# EAGLE design BATT_DISP (EAGLE 9.6.2)
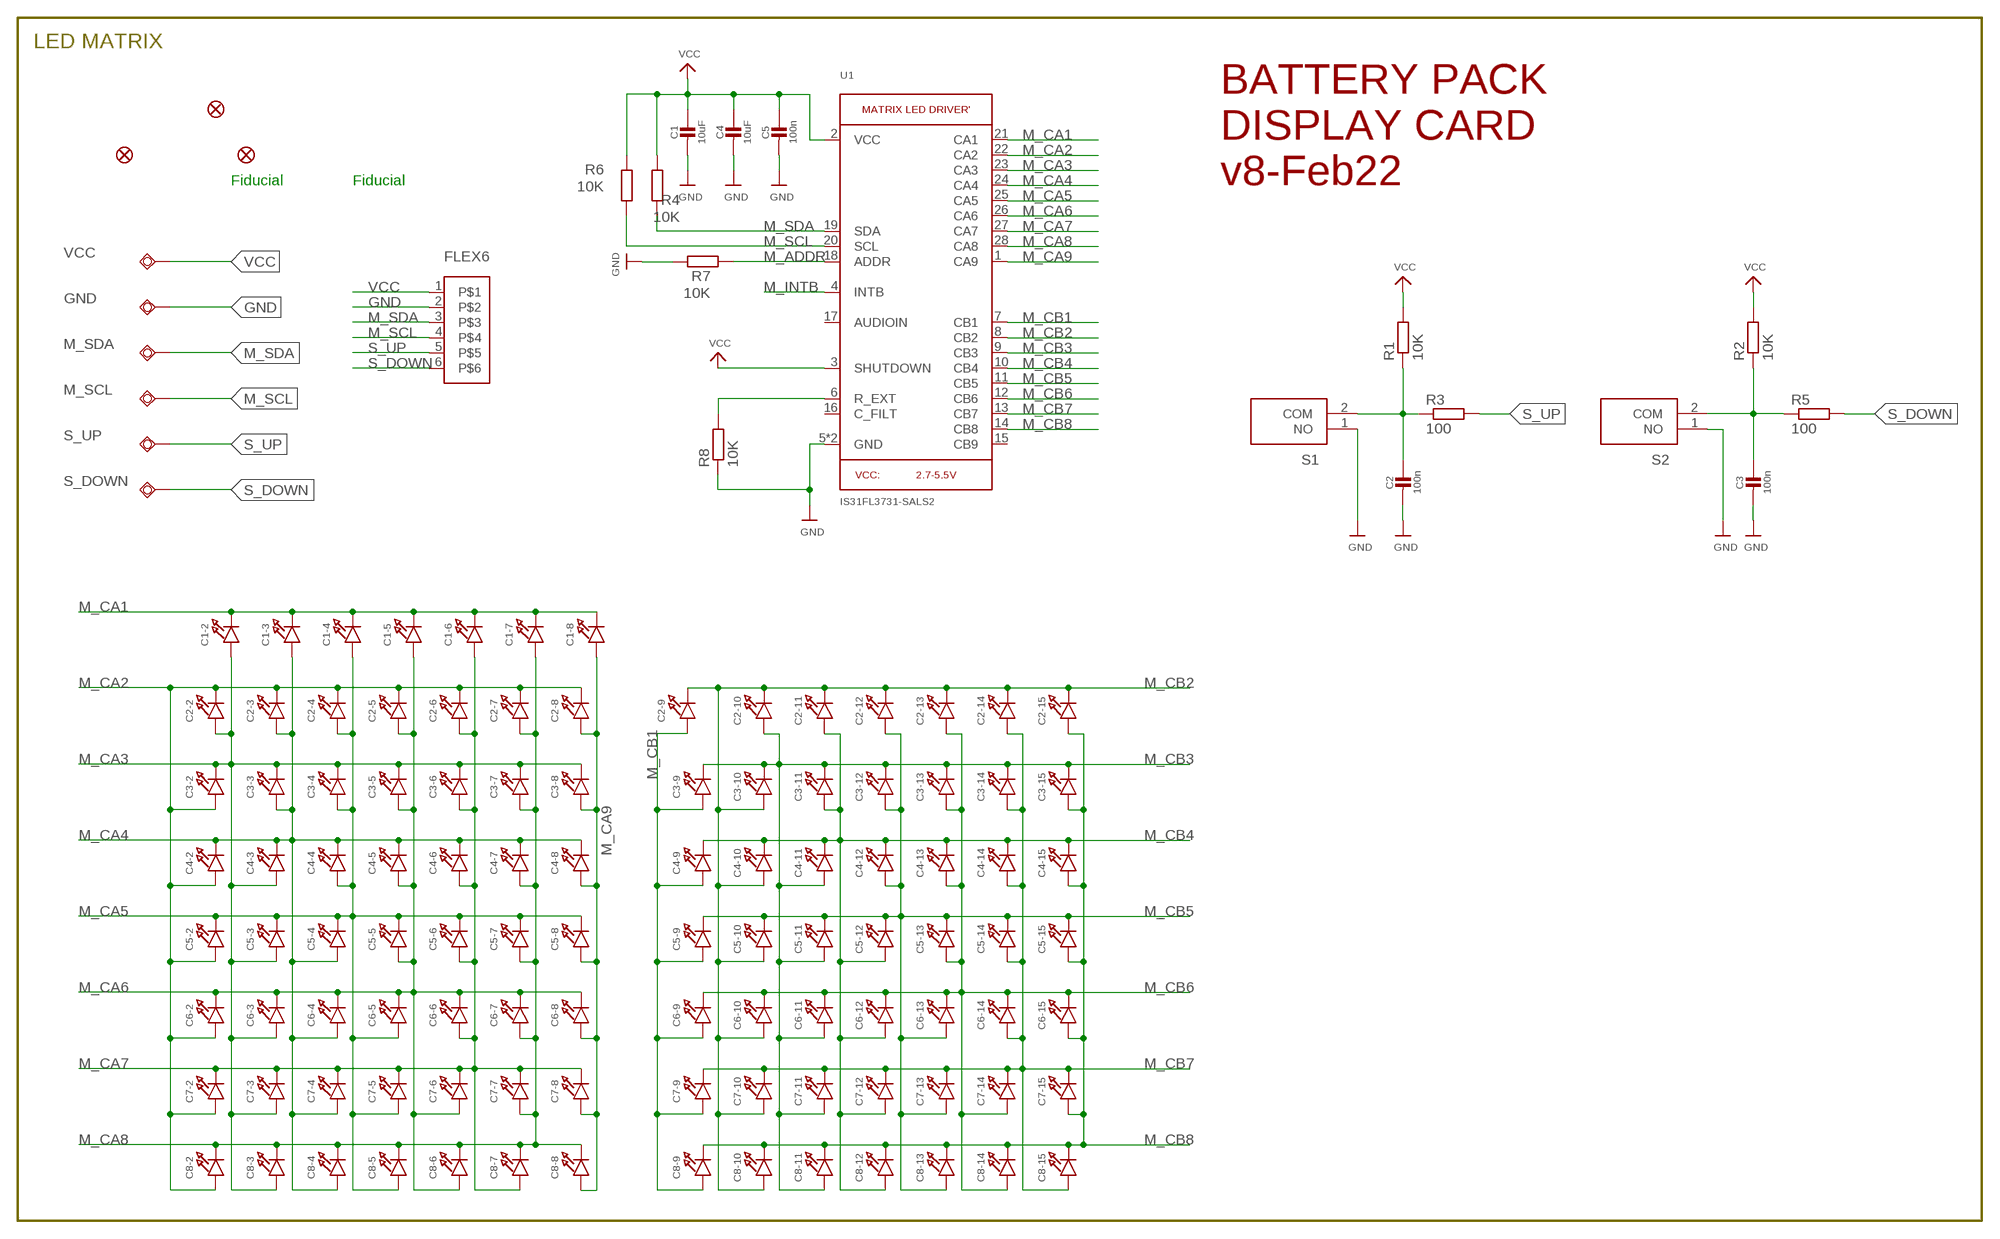
[diagram p0: schematic, sheet 1]

## Parts
C1  10uF  CAP_CERAMIC0805-NOOUTLINE  [0805-NO]
C1-2  LED0402_NOOUTLINE  [CHIPLED_0402_NOOUTLINE]
C1-3  LED0402_NOOUTLINE  [CHIPLED_0402_NOOUTLINE]
C1-4  LED0402_NOOUTLINE  [CHIPLED_0402_NOOUTLINE]
C1-5  LED0402_NOOUTLINE  [CHIPLED_0402_NOOUTLINE]
C1-6  LED0402_NOOUTLINE  [CHIPLED_0402_NOOUTLINE]
C1-7  LED0402_NOOUTLINE  [CHIPLED_0402_NOOUTLINE]
C1-8  LED0402_NOOUTLINE  [CHIPLED_0402_NOOUTLINE]
C2  100n  CAP_CERAMIC0805-NOOUTLINE  [0805-NO]
C2-2  LED0402_NOOUTLINE  [CHIPLED_0402_NOOUTLINE]
C2-3  LED0402_NOOUTLINE  [CHIPLED_0402_NOOUTLINE]
C2-4  LED0402_NOOUTLINE  [CHIPLED_0402_NOOUTLINE]
C2-5  LED0402_NOOUTLINE  [CHIPLED_0402_NOOUTLINE]
C2-6  LED0402_NOOUTLINE  [CHIPLED_0402_NOOUTLINE]
C2-7  LED0402_NOOUTLINE  [CHIPLED_0402_NOOUTLINE]
C2-8  LED0402_NOOUTLINE  [CHIPLED_0402_NOOUTLINE]
C2-9  LED0402_NOOUTLINE  [CHIPLED_0402_NOOUTLINE]
C2-10  LED0402_NOOUTLINE  [CHIPLED_0402_NOOUTLINE]
C2-11  LED0402_NOOUTLINE  [CHIPLED_0402_NOOUTLINE]
C2-12  LED0402_NOOUTLINE  [CHIPLED_0402_NOOUTLINE]
C2-13  LED0402_NOOUTLINE  [CHIPLED_0402_NOOUTLINE]
C2-14  LED0402_NOOUTLINE  [CHIPLED_0402_NOOUTLINE]
C2-15  LED0402_NOOUTLINE  [CHIPLED_0402_NOOUTLINE]
C3  100n  CAP_CERAMIC0805-NOOUTLINE  [0805-NO]
C3-2  LED0402_NOOUTLINE  [CHIPLED_0402_NOOUTLINE]
C3-3  LED0402_NOOUTLINE  [CHIPLED_0402_NOOUTLINE]
C3-4  LED0402_NOOUTLINE  [CHIPLED_0402_NOOUTLINE]
C3-5  LED0402_NOOUTLINE  [CHIPLED_0402_NOOUTLINE]
C3-6  LED0402_NOOUTLINE  [CHIPLED_0402_NOOUTLINE]
C3-7  LED0402_NOOUTLINE  [CHIPLED_0402_NOOUTLINE]
C3-8  LED0402_NOOUTLINE  [CHIPLED_0402_NOOUTLINE]
C3-9  LED0402_NOOUTLINE  [CHIPLED_0402_NOOUTLINE]
C3-10  LED0402_NOOUTLINE  [CHIPLED_0402_NOOUTLINE]
C3-11  LED0402_NOOUTLINE  [CHIPLED_0402_NOOUTLINE]
C3-12  LED0402_NOOUTLINE  [CHIPLED_0402_NOOUTLINE]
C3-13  LED0402_NOOUTLINE  [CHIPLED_0402_NOOUTLINE]
C3-14  LED0402_NOOUTLINE  [CHIPLED_0402_NOOUTLINE]
C3-15  LED0402_NOOUTLINE  [CHIPLED_0402_NOOUTLINE]
C4  10uF  CAP_CERAMIC0805-NOOUTLINE  [0805-NO]
C4-2  LED0402_NOOUTLINE  [CHIPLED_0402_NOOUTLINE]
C4-3  LED0402_NOOUTLINE  [CHIPLED_0402_NOOUTLINE]
C4-4  LED0402_NOOUTLINE  [CHIPLED_0402_NOOUTLINE]
C4-5  LED0402_NOOUTLINE  [CHIPLED_0402_NOOUTLINE]
C4-6  LED0402_NOOUTLINE  [CHIPLED_0402_NOOUTLINE]
C4-7  LED0402_NOOUTLINE  [CHIPLED_0402_NOOUTLINE]
C4-8  LED0402_NOOUTLINE  [CHIPLED_0402_NOOUTLINE]
C4-9  LED0402_NOOUTLINE  [CHIPLED_0402_NOOUTLINE]
C4-10  LED0402_NOOUTLINE  [CHIPLED_0402_NOOUTLINE]
C4-11  LED0402_NOOUTLINE  [CHIPLED_0402_NOOUTLINE]
C4-12  LED0402_NOOUTLINE  [CHIPLED_0402_NOOUTLINE]
C4-13  LED0402_NOOUTLINE  [CHIPLED_0402_NOOUTLINE]
C4-14  LED0402_NOOUTLINE  [CHIPLED_0402_NOOUTLINE]
C4-15  LED0402_NOOUTLINE  [CHIPLED_0402_NOOUTLINE]
C5  100n  CAP_CERAMIC0805-NOOUTLINE  [0805-NO]
C5-2  LED0402_NOOUTLINE  [CHIPLED_0402_NOOUTLINE]
C5-3  LED0402_NOOUTLINE  [CHIPLED_0402_NOOUTLINE]
C5-4  LED0402_NOOUTLINE  [CHIPLED_0402_NOOUTLINE]
C5-5  LED0402_NOOUTLINE  [CHIPLED_0402_NOOUTLINE]
C5-6  LED0402_NOOUTLINE  [CHIPLED_0402_NOOUTLINE]
C5-7  LED0402_NOOUTLINE  [CHIPLED_0402_NOOUTLINE]
C5-8  LED0402_NOOUTLINE  [CHIPLED_0402_NOOUTLINE]
C5-9  LED0402_NOOUTLINE  [CHIPLED_0402_NOOUTLINE]
C5-10  LED0402_NOOUTLINE  [CHIPLED_0402_NOOUTLINE]
C5-11  LED0402_NOOUTLINE  [CHIPLED_0402_NOOUTLINE]
C5-12  LED0402_NOOUTLINE  [CHIPLED_0402_NOOUTLINE]
C5-13  LED0402_NOOUTLINE  [CHIPLED_0402_NOOUTLINE]
C5-14  LED0402_NOOUTLINE  [CHIPLED_0402_NOOUTLINE]
C5-15  LED0402_NOOUTLINE  [CHIPLED_0402_NOOUTLINE]
C6-2  LED0402_NOOUTLINE  [CHIPLED_0402_NOOUTLINE]
C6-3  LED0402_NOOUTLINE  [CHIPLED_0402_NOOUTLINE]
C6-4  LED0402_NOOUTLINE  [CHIPLED_0402_NOOUTLINE]
C6-5  LED0402_NOOUTLINE  [CHIPLED_0402_NOOUTLINE]
C6-6  LED0402_NOOUTLINE  [CHIPLED_0402_NOOUTLINE]
C6-7  LED0402_NOOUTLINE  [CHIPLED_0402_NOOUTLINE]
C6-8  LED0402_NOOUTLINE  [CHIPLED_0402_NOOUTLINE]
C6-9  LED0402_NOOUTLINE  [CHIPLED_0402_NOOUTLINE]
C6-10  LED0402_NOOUTLINE  [CHIPLED_0402_NOOUTLINE]
C6-11  LED0402_NOOUTLINE  [CHIPLED_0402_NOOUTLINE]
C6-12  LED0402_NOOUTLINE  [CHIPLED_0402_NOOUTLINE]
C6-13  LED0402_NOOUTLINE  [CHIPLED_0402_NOOUTLINE]
C6-14  LED0402_NOOUTLINE  [CHIPLED_0402_NOOUTLINE]
C6-15  LED0402_NOOUTLINE  [CHIPLED_0402_NOOUTLINE]
C7-2  LED0402_NOOUTLINE  [CHIPLED_0402_NOOUTLINE]
C7-3  LED0402_NOOUTLINE  [CHIPLED_0402_NOOUTLINE]
C7-4  LED0402_NOOUTLINE  [CHIPLED_0402_NOOUTLINE]
C7-5  LED0402_NOOUTLINE  [CHIPLED_0402_NOOUTLINE]
C7-6  LED0402_NOOUTLINE  [CHIPLED_0402_NOOUTLINE]
C7-7  LED0402_NOOUTLINE  [CHIPLED_0402_NOOUTLINE]
C7-8  LED0402_NOOUTLINE  [CHIPLED_0402_NOOUTLINE]
C7-9  LED0402_NOOUTLINE  [CHIPLED_0402_NOOUTLINE]
C7-10  LED0402_NOOUTLINE  [CHIPLED_0402_NOOUTLINE]
C7-11  LED0402_NOOUTLINE  [CHIPLED_0402_NOOUTLINE]
C7-12  LED0402_NOOUTLINE  [CHIPLED_0402_NOOUTLINE]
C7-13  LED0402_NOOUTLINE  [CHIPLED_0402_NOOUTLINE]
C7-14  LED0402_NOOUTLINE  [CHIPLED_0402_NOOUTLINE]
C7-15  LED0402_NOOUTLINE  [CHIPLED_0402_NOOUTLINE]
C8-2  LED0402_NOOUTLINE  [CHIPLED_0402_NOOUTLINE]
C8-3  LED0402_NOOUTLINE  [CHIPLED_0402_NOOUTLINE]
C8-4  LED0402_NOOUTLINE  [CHIPLED_0402_NOOUTLINE]
C8-5  LED0402_NOOUTLINE  [CHIPLED_0402_NOOUTLINE]
C8-6  LED0402_NOOUTLINE  [CHIPLED_0402_NOOUTLINE]
C8-7  LED0402_NOOUTLINE  [CHIPLED_0402_NOOUTLINE]
C8-8  LED0402_NOOUTLINE  [CHIPLED_0402_NOOUTLINE]
C8-9  LED0402_NOOUTLINE  [CHIPLED_0402_NOOUTLINE]
C8-10  LED0402_NOOUTLINE  [CHIPLED_0402_NOOUTLINE]
C8-11  LED0402_NOOUTLINE  [CHIPLED_0402_NOOUTLINE]
C8-12  LED0402_NOOUTLINE  [CHIPLED_0402_NOOUTLINE]
C8-13  LED0402_NOOUTLINE  [CHIPLED_0402_NOOUTLINE]
C8-14  LED0402_NOOUTLINE  [CHIPLED_0402_NOOUTLINE]
C8-15  LED0402_NOOUTLINE  [CHIPLED_0402_NOOUTLINE]
FD1  FIDUCIALUFIDUCIAL  [FIDUCIAL-MICRO]
FD2  FIDUCIAL""  [FIDUCIAL_1MM]
FD3  FIDUCIAL""  [FIDUCIAL_1MM]
GND  TESTPAD_TPSQB1,27  [TESTPAD_B1,27]
K1  FLEX6  [FLEX6]
M_SCL  TESTPAD_TPSQB1,27  [TESTPAD_B1,27]
M_SDA  TESTPAD_TPSQB1,27  [TESTPAD_B1,27]
R1  10K  R-EU_R0603  [R0603]
R2  10K  R-EU_R0603  [R0603]
R3  100  R-EU_R0603  [R0603]
R4  10K  R-EU_R0603  [R0603]
R5  100  R-EU_R0603  [R0603]
R6  10K  R-EU_R0603  [R0603]
R7  10K  R-EU_R0603  [R0603]
R8  10K  R-EU_R0603  [R0603]
S1  KXT311LHS  [KXT311LHS]
S2  KXT311LHS  [KXT311LHS]
S_DOWN  TESTPAD_TPSQB1,27  [TESTPAD_B1,27]
S_UP  TESTPAD_TPSQB1,27  [TESTPAD_B1,27]
U1  IS31FL3731-SALS2  IS31FL3731QFN  [QFN28_4MM_0.4MM]
VCC  TESTPAD_TPSQB1,27  [TESTPAD_B1,27]

## Nets
GND: C1.2 C2.2 C3.2 C4.2 C5.2 GND.TP K1.2 R7.2 R8.1 S1.1(NO) S2.1(NO) U1.5(GND) U1.THERMAL(GND)
M_ADDR: R7.1 U1.18(ADDR)
M_CA1: C1-2.C C1-3.C C1-4.C C1-5.C C1-6.C C1-7.C C1-8.C U1.21(CA1)
M_CA2: C2-2.C C2-3.C C2-4.C C2-5.C C2-6.C C2-7.C C2-8.C C3-2.A C4-2.A C5-2.A C6-2.A C7-2.A C8-2.A U1.22(CA2)
M_CA3: C1-2.A C2-2.A C3-2.C C3-3.C C3-4.C C3-5.C C3-6.C C3-7.C C3-8.C C4-3.A C5-3.A C6-3.A C7-3.A C8-3.A U1.23(CA3)
M_CA4: C1-3.A C2-3.A C3-3.A C4-2.C C4-3.C C4-4.C C4-5.C C4-6.C C4-7.C C4-8.C C5-4.A C6-4.A C7-4.A C8-4.A U1.24(CA4)
M_CA5: C1-4.A C2-4.A C3-4.A C4-4.A C5-2.C C5-3.C C5-4.C C5-5.C C5-6.C C5-7.C C5-8.C C6-5.A C7-5.A C8-5.A U1.25(CA5)
M_CA6: C1-5.A C2-5.A C3-5.A C4-5.A C5-5.A C6-2.C C6-3.C C6-4.C C6-5.C C6-6.C C6-7.C C6-8.C C7-6.A C8-6.A U1.26(CA6)
M_CA7: C1-6.A C2-6.A C3-6.A C4-6.A C5-6.A C6-6.A C7-2.C C7-3.C C7-4.C C7-5.C C7-6.C C7-7.C C7-8.C C8-7.A U1.27(CA7)
M_CA8: C1-7.A C2-7.A C3-7.A C4-7.A C5-7.A C6-7.A C7-7.A C8-2.C C8-3.C C8-4.C C8-5.C C8-6.C C8-7.C C8-8.C U1.28(CA8)
M_CA9: C1-8.A C2-8.A C3-8.A C4-8.A C5-8.A C6-8.A C7-8.A C8-8.A U1.1(CA9)
M_CB1: C2-9.A C3-9.A C4-9.A C5-9.A C6-9.A C7-9.A C8-9.A U1.7(CB1)
M_CB2: C2-9.C C2-10.C C2-11.C C2-12.C C2-13.C C2-14.C C2-15.C C3-10.A C4-10.A C5-10.A C6-10.A C7-10.A C8-10.A U1.8(CB2)
M_CB3: C2-10.A C3-9.C C3-10.C C3-11.C C3-12.C C3-13.C C3-14.C C3-15.C C4-11.A C5-11.A C6-11.A C7-11.A C8-11.A U1.9(CB3)
M_CB4: C2-11.A C3-11.A C4-9.C C4-10.C C4-11.C C4-12.C C4-13.C C4-14.C C4-15.C C5-12.A C6-12.A C7-12.A C8-12.A U1.10(CB4)
M_CB5: C2-12.A C3-12.A C4-12.A C5-9.C C5-10.C C5-11.C C5-12.C C5-13.C C5-14.C C5-15.C C6-13.A C7-13.A C8-13.A U1.11(CB5)
M_CB6: C2-13.A C3-13.A C4-13.A C5-13.A C6-9.C C6-10.C C6-11.C C6-12.C C6-13.C C6-14.C C6-15.C C7-14.A C8-14.A U1.12(CB6)
M_CB7: C2-14.A C3-14.A C4-14.A C5-14.A C6-14.A C7-9.C C7-10.C C7-11.C C7-12.C C7-13.C C7-14.C C7-15.C C8-15.A U1.13(CB7)
M_CB8: C2-15.A C3-15.A C4-15.A C5-15.A C6-15.A C7-15.A C8-9.C C8-10.C C8-11.C C8-12.C C8-13.C C8-14.C C8-15.C U1.14(CB8)
M_INTB: U1.4(INTB)
M_SCL: K1.4 M_SCL.TP R6.1 U1.20(SCL)
M_SDA: K1.3 M_SDA.TP R4.1 U1.19(SDA)
N$1: C3.1 R2.1 R5.1 S2.2(COM)
N$2: C2.1 R1.1 R3.1 S1.2(COM)
R_EXT: R8.2 U1.6(R_EXT)
S_DOWN: K1.6 R5.2 S_DOWN.TP
S_UP: K1.5 R3.2 S_UP.TP
VCC: C1.1 C4.1 C5.1 K1.1 R1.2 R2.2 R4.2 R6.2 U1.2(VCC) U1.3(SHUTDOWN) VCC.TP
Unconnected: U1.15(CB9) U1.16(C_FILT) U1.17(AUDIOIN)

## Notes on the sheet
- LED MATRIX
- Fiducial | Fiducial
- BATTERY PACK
  DISPLAY CARD
  v8-Feb22

## Library data of the parts
C1-C5 = microbuilder:CAP_CERAMIC: Ceramic Capacitors For new designs, use the packages preceded by an '_' character since they are more reliable: The following footprints should be used on most boards: _0402 - Standard footprint for regular board layouts _0603 - Standard footprint for regular board layouts _0805 - Standard footprint for regular board layouts _1206 - Standard footprint for regular board layouts For extremely tight-pitch boards where space is at a premium, the following 'micro-pitch' footprints can be used (smaller pads, no silkscreen outline, etc.): _0402MP - Micro-pitch footprint for very dense/compact boards _0603MP - Micro-pitch footprint for very dense/compact boards _0805MP - Micro-pitch footprint for very dense/compact boards _1206MP - Micro-pitch footprint for very dense/compact boards
C1-2-C1-8 C2-2-C2-15 C3-2-C3-15 C4-2-C4-15 C5-2-C5-15 C6-2-C6-15 C7-2-C7-15 C8-2-C8-15 = microbuilder:LED: LED 0603 - 0603 Surface Mount Package 2mA: Green LED - Low Power (3.9mcd, 2ma, 1.7Vf) - Digikey: 475-2709-2-ND Orange LED - Low Power (9.8mcd, 2ma, 1.8Vf) - Digikey: 475-1194-2-ND Red LED - Low Power (5mcd, 2ma, 1.8Vf) - Digikey: 475-1195-2-ND Yellow LED - Low Power (7mcd, 2ma, 1.8Vf) - Digikey: 475-1196-2-ND 5mA: Blue LED - Low Power (17mcd, 5ma, 2.9Vf) - Digikey: LNJ937W8CRACT-ND 0805 - 0805 Surface Mount Package 2mA: Red LED (8.8mcd, 2mA, 1.8Vf, Clear) - Low Power [Digikey: 475-2510-1-ND] Green LED (5mcd, 2mA, 1.8Vf, Clear) - Low Power [Digikey: 475-2730-1-ND] Yellow LED (11.3mcd, 2mA, 1.8Vf, Clear) - Low Power [Digikey: 475-2555-1-ND] 20mA: Red LED (104mcd, 20mA, Diffused) - LS R976 [Digikey: 475-1278-6-ND] Red LED (12mcd, 20mA, 2.0Vf, Clear) - APT2012EC [Digikey: 754-1128-1-ND] Green LED (15mcd, 20mA, 2.2Vf, Clear) - APT2012GC [Digikey: 754-1131-1-ND] Orange LED (160mcd, 20mA, 2.1Vf, Clear) - APT2012SECK [Digikey: 754-1130-1-ND] 1206 - 1206 Surface Mount Package Green LED (26mcd, 20mA, Diffused) - LG N971 [Digikey: 475-1407-6-ND] Red LED (15mcd, 20mA, Diffused) - LH N974 [Digikey: 475-1416-6-ND] Cree - Cree High-Power Surface Mount LEDs XPEBWT-L1-0000-00D50 - White 111lm 350mA 2.9Vf 6200K 110° XTEAWT-00-0000-00000LEE3 - White 114lm 350mA 2.85Vf 5000K 115° Everlight - Everlight 45-21 Series Surface Mount LEDs 45-21/QK2C-B2832AC2CB2/2T - Warm White 2000mcd 20mA 3.25Vf 3050K 120° 45-21/LK2C-B38452C4CB2/2T - Nuetral White 2000mcd 20mA 3.25Vf 4150K 120° 45-21/LK2C-B50634C6CB2/2T - Cold White 2200mcd 20mA 3.25Vf 5650K 120° PLCC2 Reverse Mount LS T77K-J1L2-1-0-2-R18-Z - Red 11.25mcd 2mA 1.8Vf 630nm 120° LO T77K-L1M2-24-Z - Orange 19.6mcd 2mA 1.8Vf 606nm 120° LY T77K-K2M1-26-Z - Yellow 15.7mcd 2mA 1.8Vf 587nm 120°
FD1 = SparkFun-Aesthetics:FIDUCIAL: Fiducial Alignment Points
FD2 FD3 = microbuilder:FIDUCIAL: Fiducial Alignment Points; BOM: EXCLUDE
GND M_SCL M_SDA S_DOWN S_UP VCC = BeagleBone_Blue_R3:TESTPAD_TPSQ: Test pad
K1 = Flex_3mm:FLEX6: WR-FPC 1mm SMT Horiz. Bot. Contact Hinge type WR-FPC 1mm 06 pins Hinge type SMT Horizontal Bottom Contact ;=>Code : Con_FPC_ZIF_1.00_6861xx148922_686106148922 <http://katalog.we-online.de/media/images/eican/Con_FPC_ZIF_1.00_686110148922_pf2.jpg> Details see: http://katalog.we-online.de/em/datasheet/6861xx148922.pdf Created 2014-10-08, Karrer Zheng 2014 (C) Wurth Elektronik
R1-R8 = rcl:R-EU_: RESISTOR, European symbol; SPICEPREFIX: R
S1 S2 = switch momentary CK KXT311LHS:KXT311LHS: Tactile Switches 20mA 15VDC 100gf 0.6mm SPST NO SMT Source: Datasheet <https://datasheet.lcsc.com/szlcsc/C-K-KXT311LHS_C221820.pdf>; DESCRIPTION: Tactile Switches 20mA 15VDC 100gf 0.6mm SPST NO SMT; HEIGHT: 0.7mm; MANUFACTURER_NAME: C & K COMPONENTS; MANUFACTURER_PART_NUMBER: KXT311LHS; MOUSER_PART_NUMBER: 611-KXT311LHS; MOUSER_PRICE-STOCK: https://www.mouser.co.uk/ProductDetail/CK/KXT311LHS/?qs=%2FQ2qp2Z%2FWFxZqSWVDr5IpA%3D%3D
U1 = microbuilder:IS31FL3731: IS31FL3731 PWM LED Matrix Driver

## Board
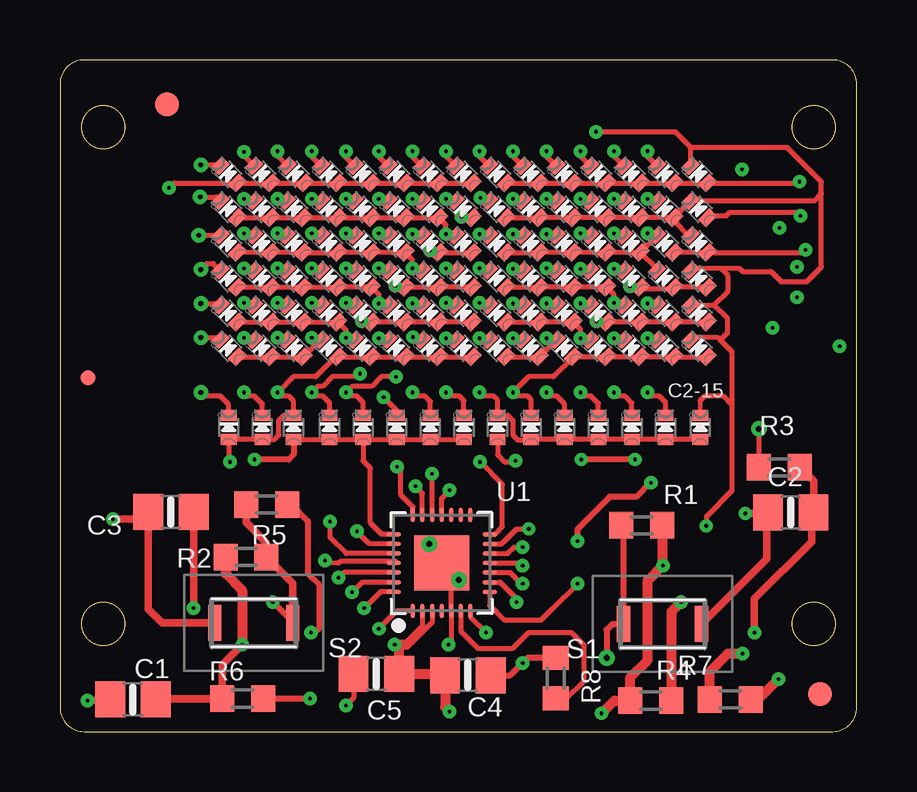
[diagram p1: board, top side]
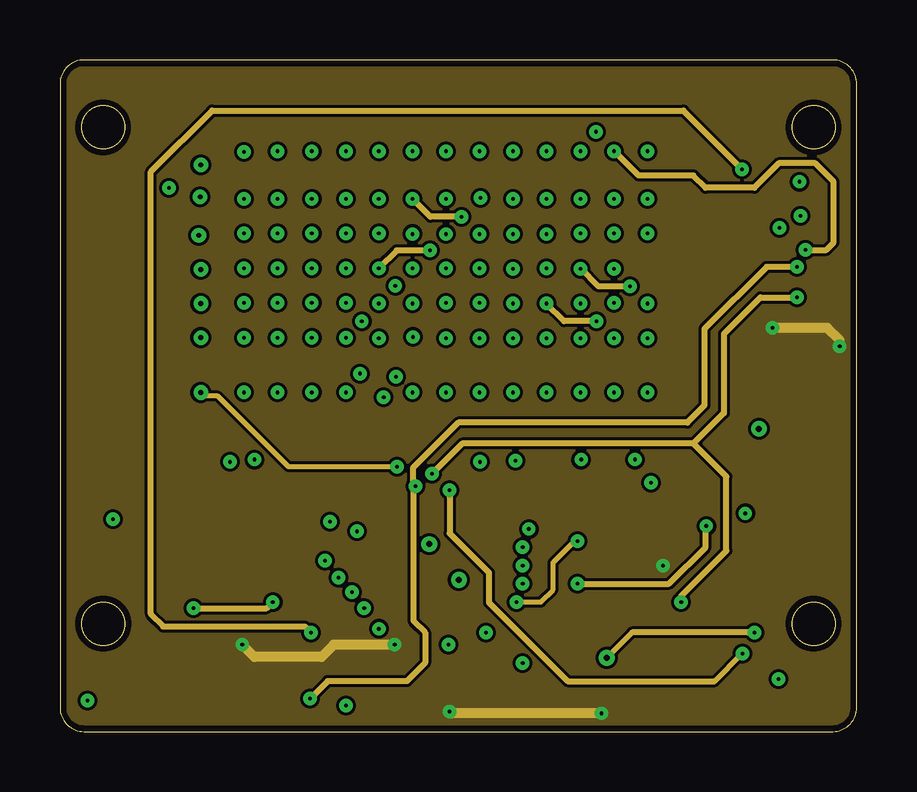
[diagram p2: board, inner layer Route2]
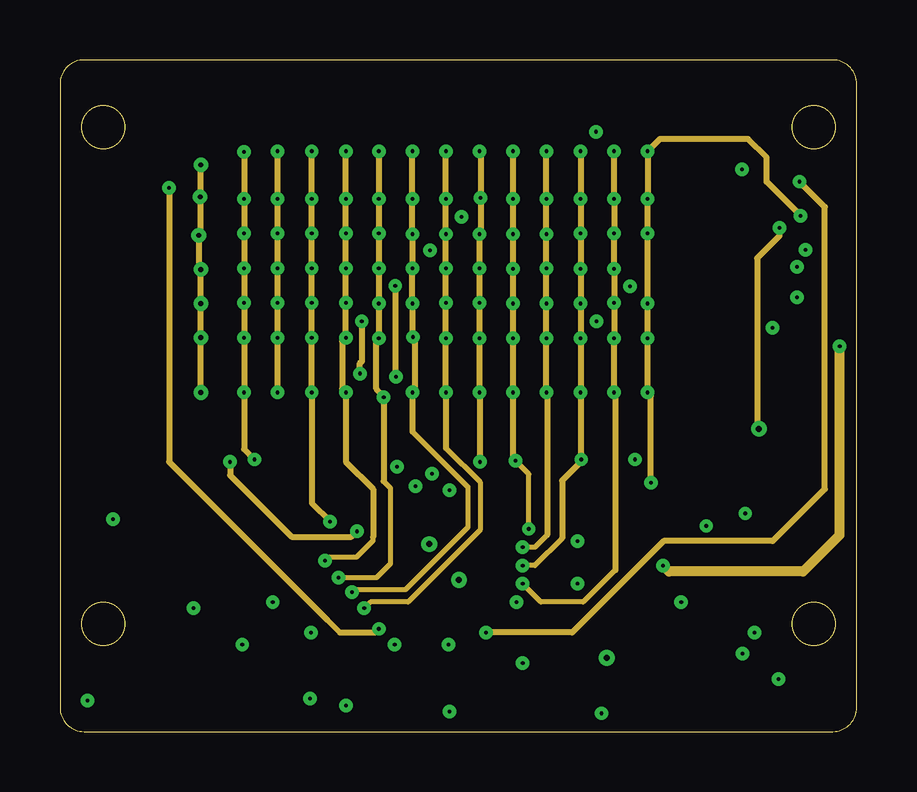
[diagram p3: board, inner layer Route15]
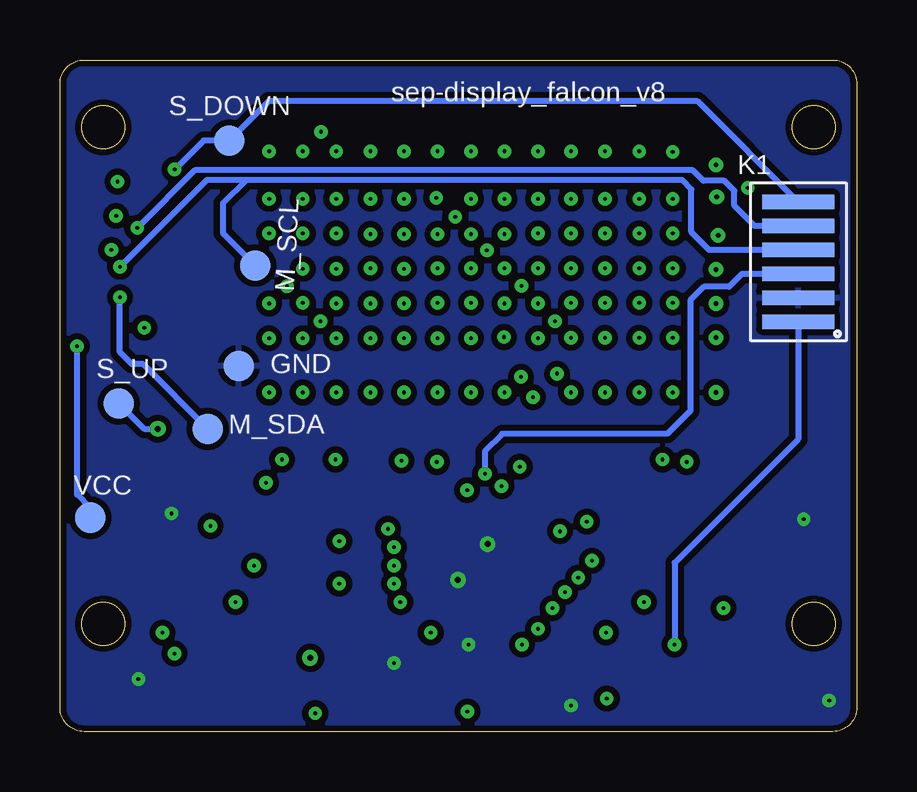
[diagram p4: board, bottom side, seen from below]

Size 33.2 x 28 mm. Coordinates in mm from the lower left corner, seen from the top.
Outline: 0,27 0,1 arc90 1,0 32.2,0 arc90 33.2,1 33.2,27 arc90 32.2,28 1,28 arc90 0,27
Outline: circle at 31.4,4.5 radius 0.9
Outline: circle at 1.8,4.5 radius 0.9
Outline: circle at 1.8,25.19 radius 0.9
Outline: circle at 31.4,25.19 radius 0.9
Outline: circle at 31.4,4.49 radius 0.9
Outline: circle at 1.8,4.49 radius 0.9
Copper layers (1*2*15*16): Top 0.035mm / dielectric 1.5mm / Route2 0.035mm / dielectric 0.15mm / Route15 0.035mm / dielectric 0.2mm / Bottom 0.035mm
Design rules "adafruit *": minimum track width 7mil, minimum drill 6mil, track to track 5mil, track to pad 5mil, pad to pad 5mil, via to via 7mil, smd to smd 5mil, copper to edge 10mil, drill to drill 8mil, minimum pad ring 10mil, minimum via ring 8mil, stop-mask expansion 2mil, vias tented up to drill 20mil, thermal gap 10mil

### Footprints (pad centres in the part's own frame; a part is rotated, then mirrored left to right if it is on the bottom)
0805-NO = smd 1.24 x 1.5: 1 -0.95,0; 2 0.95,0
CHIPLED_0402_NOOUTLINE = smd 0.65 x 0.45: A 0,-0.5; C 0,0.5
FIDUCIAL-MICRO = smd 0.635 x 0.635: 1 0,0
FIDUCIAL_1MM = smd 1 x 1: 1 0,0
TESTPAD_B1,27 = smd 1.27 x 1.27: TP 0,0
FLEX6 = smd 0.6 x 3: 1 -2.5,-0.35; 2 -1.5,-0.35; 3 -0.5,-0.35; 4 0.5,-0.35; 5 1.5,-0.35; 6 2.5,-0.35
R0603 = smd 1 x 1.1: 1 -0.85,0; 2 0.85,0
KXT311LHS = smd 0.55 x 1.5: 1 -1.625,0; 2 1.625,0
QFN28_4MM_0.4MM = smd 0.6 x 0.18: 1 -2,1.2; 2 -2,0.8; 3 -2,0.4; 4 -2,0; 5 -2,-0.4; 6 -2,-0.8; 7 -2,-1.2; 15 2,-1.2; 16 2,-0.8; 17 2,-0.4; 18 2,0; 19 2,0.4; 20 2,0.8; 21 2,1.2 | smd 0.18 x 0.6: 8 -1.2,-2; 9 -0.8,-2; 10 -0.4,-2; 11 0,-2; 12 0.4,-2; 13 0.8,-2; 14 1.2,-2; 22 1.2,2; 23 0.8,2; 24 0.4,2; 25 0,2; 26 -0.4,2; 27 -0.8,2; 28 -1.2,2 | smd 2.3 x 2.3: THERMAL 0,0

### Placement (x,y rotation side)
C1  3.04,1.34 180 top
C1-2  7.03,12.68 0 top
C1-3  7.03,15.98 45 top
C1-4  7.03,17.43 45 top
C1-5  7.03,18.88 45 top
C1-6  7.03,20.33 45 top
C1-7  7.03,21.78 45 top
C1-8  7.03,23.23 45 top
C2  30.45,9.14 180 top
C2-2  8.43,12.68 0 top
C2-3  8.43,15.98 45 top
C2-4  8.43,17.43 45 top
C2-5  8.43,18.88 45 top
C2-6  8.43,20.33 45 top
C2-7  8.43,21.78 45 top
C2-8  8.43,23.23 45 top
C2-9  26.63,23.23 45 top
C2-10  26.63,21.78 45 top
C2-11  26.63,20.33 45 top
C2-12  26.63,18.88 45 top
C2-13  26.63,17.43 45 top
C2-14  26.63,15.98 45 top
C2-15  26.68,12.67 0 top
C3  4.62,9.15 180 top
C3-2  9.73,12.68 0 top
C3-3  9.78,15.98 45 top
C3-4  9.78,17.43 45 top
C3-5  9.78,18.88 45 top
C3-6  9.78,20.33 45 top
C3-7  9.78,21.78 45 top
C3-8  9.83,23.23 45 top
C3-9  25.23,23.23 45 top
C3-10  25.23,21.78 45 top
C3-11  25.23,20.33 45 top
C3-12  25.23,18.88 45 top
C3-13  25.23,17.43 45 top
C3-14  25.23,15.98 45 top
C3-15  25.23,12.68 0 top
C4  16.99,2.35 0 top
C4-2  11.23,12.68 0 top
C4-3  11.23,15.98 45 top
C4-4  11.23,17.43 45 top
C4-5  11.23,18.88 45 top
C4-6  11.23,20.33 45 top
C4-7  11.23,21.78 45 top
C4-8  11.23,23.23 45 top
C4-9  23.83,23.23 45 top
C4-10  23.83,21.78 45 top
C4-11  23.83,20.33 45 top
C4-12  23.83,18.88 45 top
C4-13  23.83,17.43 45 top
C4-14  23.83,15.98 45 top
C4-15  23.83,12.68 0 top
C5  13.18,2.4 180 top
C5-2  12.63,12.68 0 top
C5-3  12.63,15.98 45 top
C5-4  12.63,17.43 45 top
C5-5  12.63,18.88 45 top
C5-6  12.63,20.33 45 top
C5-7  12.63,21.78 45 top
C5-8  12.63,23.23 45 top
C5-9  22.43,23.23 45 top
C5-10  22.43,21.78 45 top
C5-11  22.43,20.33 45 top
C5-12  22.43,18.88 45 top
C5-13  22.43,17.43 45 top
C5-14  22.43,15.98 45 top
C5-15  22.43,12.68 0 top
C6-2  14.03,12.68 0 top
C6-3  14.03,15.98 45 top
C6-4  14.03,17.43 45 top
C6-5  14.03,18.88 45 top
C6-6  14.03,20.33 45 top
C6-7  14.03,21.78 45 top
C6-8  14.03,23.23 45 top
C6-9  21.03,23.23 45 top
C6-10  21.03,21.78 45 top
C6-11  21.03,20.33 45 top
C6-12  21.03,18.88 45 top
C6-13  21.03,17.43 45 top
C6-14  21.03,15.98 45 top
C6-15  21.03,12.68 0 top
C7-2  15.43,12.68 0 top
C7-3  15.43,15.98 45 top
C7-4  15.43,17.43 45 top
C7-5  15.43,18.88 45 top
C7-6  15.43,20.33 45 top
C7-7  15.43,21.78 45 top
C7-8  15.43,23.23 45 top
C7-9  19.63,23.23 45 top
C7-10  19.63,21.78 45 top
C7-11  19.63,20.33 45 top
C7-12  19.63,18.88 45 top
C7-13  19.63,17.43 45 top
C7-14  19.63,15.98 45 top
C7-15  19.63,12.68 0 top
C8-2  16.83,12.68 0 top
C8-3  16.83,15.98 45 top
C8-4  16.83,17.43 45 top
C8-5  16.83,18.88 45 top
C8-6  16.83,20.33 45 top
C8-7  16.83,21.78 45 top
C8-8  16.83,23.23 45 top
C8-9  18.23,23.23 45 top
C8-10  18.23,21.78 45 top
C8-11  18.23,20.33 45 top
C8-12  18.23,18.88 45 top
C8-13  18.23,17.43 45 top
C8-14  18.23,15.98 45 top
C8-15  18.23,12.68 0 top
FD1  1.17,14.75 0 top
FD2  4.46,26.15 0 top
FD3  31.67,1.57 0 top
GND  25.75,15.24 0 bottom
K1  2.8,19.58 90 bottom
M_SCL  25.06,19.43 0 bottom
M_SDA  27.04,12.62 0 bottom
R1  24.24,8.6 0 top
R2  7.75,7.28 180 top
R3  29.97,11.02 180 top
R4  24.62,1.29 180 top
R5  8.61,9.46 0 top
R6  7.61,1.37 180 top
R7  27.93,1.34 0 top
R8  20.66,2.23 270 top
S1  25.11,4.48 180 top
S2  8.07,4.52 0 top
S_DOWN  26.15,24.64 0 bottom
S_UP  30.75,13.68 0 bottom
U1  15.9,7.03 90 top
VCC  31.93,8.92 0 bottom

### Tracks (layer width: path | path; a pad name or v marks a point on that pad's centre or on a via)
GND  (via drill 0.15, 0.25)
  Top 0.203: U1.THERMAL 16.3,6.62 U1.5 16.3,3.74 v16.18,3.63 | C5.2 12.23,1.4 v11.91,1.08
  Top 0.254: R8.1 19.5,3.08 v19.28,2.86 18.77,2.35 C4.2
  Top 0.305: v1.15,1.29 2.09,1.29 C1.2 | v2.21,8.86 3.38,8.86 C3.2 3.67,5.1 4.25,4.52 S2.1 | C2.2 29.46,9.09 | 29.46,9.09 v28.55,9.09 | R7.2 29.09,1.34 | S1.1 29.46,7.2 29.46,9.09
  Top 0.406: 29.09,1.34 v29.94,2.19
  other vias: 15.39,7.81 16.62,6.32
  pour Bottom (isolate 0.254): -0.03,28.01 33.8,28.01 33.8,0.07 -0.03,0.07
M_ADDR  (via drill 0.15)
  Top 0.203: U1.18 15.9,9.72 v16.24,10.06
  Top 0.406: R7.1 27.08,2.5 27.84,3.25 v28.43,3.25
  Route2 0.203: 27.28,2.1 v28.43,3.25 | v16.23,10.05 v16.24,10.06
  Route2 0.254: 27.28,2.1 21.15,2.1 17.87,5.38 17.87,6.63 16.23,8.27 v16.23,10.05
M_CA1  (via drill 0.15, 0.2)
  Top 0.2: 6.11,19.51 6.4,19.51 C1-5.C | v5.87,17.85 6.61,17.85 C1-4.C | C1-6.C v5.79,20.68 v5.78,20.69 | v5.87,16.42 6.59,16.42 C1-3.C | v5.87,23.63 6.63,23.63 C1-8.C | v5.84,22.29 6.52,22.29 C1-7.C
  Top 0.203: C1-2.C 7.03,13.63 6.68,13.98 6.02,13.98 v5.87,14.14 | v5.87,19.27 6.11,19.51 | U1.21 14.7,9.37 14.2,9.87 14.2,10.89 v14.05,11.04
  Route2 0.203: v14.05,11.04 9.53,11.04 6.58,13.98 6.02,13.98 v5.87,14.14
  Route15 0.254: v5.87,14.14 v5.87,16.42 v5.87,17.85 v5.87,19.27 5.78,19.36 v5.78,20.69 5.84,20.75 v5.84,22.29 5.84,23.6 v5.87,23.63
M_CA2  (via drill 0.15)
  Top 0.2: v7.67,20.77 7.99,20.77 C2-6.C | C2-7.C 7.99,22.21 v7.67,22.21 | v7.67,17.87 7.99,17.87 C2-4.C | v7.67,16.42 7.99,16.42 C2-3.C | v7.67,24.17 7.67,23.99 C2-8.C | v7.67,19.32 7.99,19.32 C2-5.C
  Top 0.203: C3-2.A C4-2.A C5-2.A | C5-2.A C6-2.A C7-2.A C8-2.A | C2-2.C 8.43,13.66 8.1,13.98 7.82,13.98 v7.67,14.14 | 9.73,11.55 | U1.22 13.41,8.22 12.93,8.7 12.93,10.99 12.63,11.29 C5-2.A
  Top 0.254: 9.73,11.55 9.53,11.34 v8.1,11.34 | C3-2.A 9.73,11.55
  Route15 0.254: v7.67,24.17 v7.67,22.21 v7.67,20.77 v7.67,19.32 v7.67,17.87 v7.67,16.42 v7.67,14.14 7.67,11.77 v8.1,11.34
M_CA3  (via drill 0.15)
  Top 0.2: 11.09,15.23 11.48,15.62 C4-3.A C5-3.A C6-3.A C7-3.A C8-3.A | C3-4.C 9.34,17.87 v9.07,17.87 | v9.07,20.77 9.34,20.77 C3-6.C | v9.07,19.32 9.34,19.32 C3-5.C | v9.07,24.2 9.07,23.99 C3-8.C | v9.07,22.21 9.34,22.21 C3-7.C | v9.07,16.42 9.34,16.42 C3-3.C
  Top 0.203: 11.09,15.23 10.66,14.8 9.73,14.8 v9.07,14.14 9.22,13.98 9.53,13.98 9.73,13.78 C3-2.C 9.33,13.18 9.12,12.97 9.12,12.36 8.94,12.18 C2-2.A C1-2.A 7.03,11.3 v7.09,11.24 | U1.23 12.89,7.82 v12.37,8.35
  Route15 0.254: v9.07,24.2 v9.07,22.21 v9.07,20.77 v9.07,19.32 v9.07,17.87 v9.07,16.42 v9.07,14.14 | v7.09,11.24 7.09,10.69 9.65,8.12 12.14,8.12 v12.37,8.35
M_CA4  (via drill 0.15)
  Top 0.2: C8-4.A C7-4.A C6-4.A C5-4.A 12.95,17.11 v12.57,17.11 | v10.49,22.21 10.79,22.21 C4-7.C | C1-3.A C2-3.A C3-3.A 10.84,16.33 C4-3.C 10.79,16.42 v10.49,16.42 | v10.49,24.2 10.49,23.97 C4-8.C | v10.49,20.77 10.79,20.77 C4-6.C | v10.49,19.32 10.79,19.32 C4-5.C | v10.49,17.87 10.79,17.87 C4-4.C
  Top 0.203: C4-2.C 11.23,13.7 10.95,13.98 10.64,13.98 v10.49,14.14 10.74,14.39 10.95,14.39 11.35,14.8 12.37,14.8 v12.5,14.92 | U1.24 11.92,7.42 11.25,8.1 v11.25,8.75
  Route15 0.254: v10.49,24.2 v10.49,22.21 v10.49,20.77 v10.49,19.32 v10.49,17.87 v10.49,16.42 v10.49,14.14 10.49,9.51 v11.25,8.75 | v12.57,17.11 12.57,15.43 12.5,15.36 v12.5,14.92
M_CA5  (via drill 0.15)
  Top 0.178: 11.61,7.02 11.14,7.02 v11.04,7.13
  Top 0.2: C1-4.A C2-4.A C3-4.A C4-4.A 11.91,16.74 11.91,16.73 | v11.91,22.21 12.19,22.21 C5-7.C | v11.91,19.32 12.19,19.32 C5-5.C | C8-5.A C7-5.A C6-5.A 14.33,18.58 v13.97,18.58 | v11.91,16.42 12.19,16.42 C5-3.C | C5-8.C 11.91,23.94 v11.91,24.2 | v11.91,20.77 12.19,20.77 C5-6.C | v11.91,17.87 12.19,17.87 C5-4.C
  Top 0.203: C5-2.C 12.63,13.72 12.37,13.98 12.07,13.98 v11.91,14.14 12.17,14.39 12.98,14.39 13.39,14.8 v14,14.8 | 11.91,16.73 v11.91,16.42 | U1.25 13.94,7.02 14.01,7.09 11.68,7.09 11.61,7.02
  Route15 0.178: v11.04,7.13 11.18,7.28
  Route15 0.203: 14,18.56 v13.97,18.58 | 11.18,7.28 12.36,7.28 13.05,7.96 13.05,8.11
  Route15 0.254: v11.91,24.2 v11.91,22.21 v11.91,20.77 v11.91,19.32 v11.91,17.87 v11.91,16.42 11.75,16.26 11.75,14.3 v11.91,14.14 11.91,11.24 13.05,10.11 13.05,8.11 | v14,14.8 14,18.56
M_CA6  (via drill 0.15)
  Top 0.2: C1-5.A C2-5.A C3-5.A C4-5.A 11.6,18.54 12.97,18.54 C5-5.A 13.28,18.22 v13.28,17.85 13.61,17.85 C6-4.C | C8-6.A C7-6.A 15.7,20.06 v15.42,20.06 | v13.28,20.77 13.59,20.77 C6-6.C | v13.28,19.32 13.59,19.32 C6-5.C | v13.28,24.2 13.28,23.97 C6-8.C | v13.28,22.21 13.59,22.21 C6-7.C | v13.28,16.4 13.61,16.4 C6-3.C
  Top 0.203: C6-2.C 14.03,13.39 v13.49,13.93 | U1.26 11.82,6.62 v11.61,6.42
  Route2 0.254: v15.42,20.06 14.02,20.06 v13.28,19.32
  Route15 0.203: v13.49,13.93 13.49,13.98 | 13.18,16.3 v13.28,16.4 | 13.49,10.43 13.76,10.15 13.76,7 13.18,6.42 v11.61,6.42
  Route15 0.254: v13.28,24.2 v13.28,22.21 v13.28,20.77 v13.28,19.32 v13.28,17.85 v13.28,16.4 | 13.49,13.98 13.18,14.29 13.18,16.3 | v13.49,13.93 13.49,10.43
M_CA7  (via drill 0.15)
  Top 0.2: C1-6.A C2-6.A C3-6.A C4-6.A C5-6.A C6-6.A 14.68,19.68 v14.68,19.32 14.99,19.32 C7-5.C | v16.73,21.46 17.15,21.46 C8-7.A | v14.68,22.21 14.99,22.21 C7-7.C | v14.68,24.2 14.68,23.98 C7-8.C | v14.68,20.74 15.02,20.74 C7-6.C | v14.71,16.45 14.96,16.45 C7-3.C | v14.68,17.85 15.01,17.85 C7-4.C
  Top 0.203: C7-2.C 15.43,13.77 15.22,13.98 14.83,13.98 v14.68,14.14 | U1.27 12.59,6.22 v12.17,5.81
  Route2 0.254: v16.73,21.46 15.43,21.46 v14.68,22.21
  Route15 0.203: v14.71,16.45 14.78,16.38 | v14.68,14.14 14.78,14.23 | 14.71,17.82 v14.68,17.85 | 14.68,12.51 16.99,10.2 16.99,8.51 14.39,5.91 12.27,5.91 v12.17,5.81
  Route15 0.254: 14.78,16.38 14.78,14.23 | v14.71,16.45 14.71,17.82 | v14.68,17.85 v14.68,19.32 v14.68,20.74 v14.68,22.21 v14.68,24.2 | v14.68,14.14 14.68,12.51
M_CA8  (via drill 0.15)
  Top 0.2: C1-7.A C2-7.A C3-7.A C4-7.A C5-7.A C6-7.A C7-7.A 16.08,21.13 v16.08,20.74 16.42,20.74 C8-6.C | v16.08,24.2 16.08,23.98 C8-8.C | v16.08,19.32 16.39,19.32 C8-5.C | v16.08,22.21 16.39,22.21 C8-7.C | v16.08,16.4 16.41,16.4 C8-3.C | v16.08,17.87 16.39,17.87 C8-4.C
  Top 0.203: C8-2.C 16.83,13.79 16.64,13.98 16.23,13.98 v16.08,14.14 | U1.28 13.35,5.82 v12.68,5.15
  Route15 0.203: 16.08,11.82 17.5,10.4 17.5,8.4 14.5,5.4 12.93,5.4 v12.68,5.15
  Route15 0.254: v16.08,24.2 v16.08,22.21 v16.08,20.74 v16.08,19.32 v16.08,17.87 v16.08,16.4 v16.08,14.14 16.08,11.82
M_CA9  (via drill 0.15)
  Top 0.2: C8-8.A C7-8.A C6-8.A C5-8.A C4-8.A C3-8.A C2-8.A C1-8.A 4.75,22.87
  Top 0.203: v4.55,22.67 4.75,22.87 | U1.1 14.03,5.02 v13.28,4.28
  Route15 0.203: 11.15,4.64 11.66,4.13
  Route15 0.254: 11.15,4.64 4.55,11.24 v4.55,22.67 | 11.66,4.13 13.13,4.13 v13.28,4.28
M_CB1  (via drill 0.15)
  Top 0.2: C8-9.A C7-9.A
  Top 0.203: C7-9.A C6-9.A C5-9.A C4-9.A C3-9.A C2-9.A 30.76,22.87 v30.81,22.93 | U1.7 17.1,4.78 v17.76,4.13
  Route15 0.254: v30.81,22.93 31.87,21.87 31.87,10.11 29.69,7.94 25.15,7.94 21.34,4.13 v17.76,4.13
M_CB2  (via drill 0.15)
  Top 0.178: v26.93,8.57 26.95,8.59 | C2-12.C 26.37,19.32 | C2-14.C 26.39,16.45 | C2-15.C 26.68,13.79
  Top 0.2: 20.55,5.15 v21.57,6.16 | C8-10.A C7-10.A | 26.39,16.45 27.4,16.45 | C2-13.C 27.27,17.78 | 26.37,19.32 27.52,19.32 | C2-11.C 26.21,20.68 25.58,21.31 | 26.68,13.79 26.89,14.01 27.61,14.01 28,13.62
  Top 0.203: C7-10.A C6-10.A C5-10.A C4-10.A C3-10.A 25.58,21.31 25.58,21.3 25.58,21.43 C2-10.C 31.44,22.13 31.73,22.42 | 27.52,16.33 27.81,16.63 27.81,17.24 27.27,17.78 27.81,18.33 27.81,19.03 27.52,19.32 28.3,19.32 28.44,19.18 29.63,19.18 30.05,18.76 31.12,18.76 31.73,19.37 31.73,22.42 | 27.52,16.33 28,15.85 28,13.62 28,10.03 26.95,8.97 26.95,8.59 | 27.4,16.45 27.52,16.33 | v22.33,25.01 25.63,25.01 26.28,24.36 | C2-9.C 26.28,24.36 | 31.73,22.42 31.73,22.93 30.29,24.36 26.28,24.36 | U1.8 17.9,5.25 18.52,4.64 20.04,4.64 20.55,5.15
  Route2 0.203: 26.9,8.54 v26.93,8.57
  Route2 0.254: v21.57,6.16 25.38,6.16 26.9,7.69 26.9,8.54
M_CB3  (via drill 0.15)
  Top 0.2: C8-11.A C7-11.A
  Top 0.203: C4-11.A C5-11.A C6-11.A C7-11.A | C3-15.C 25.23,13.72 24.97,13.98 24.64,13.98 v24.49,14.14 | C3-12.C 24.88,19.28 C4-11.A | C4-11.A 24.18,19.99 C3-11.C 24.79,20.77 v24.49,20.77 | C3-9.C 24.49,23.97 v24.49,24.2 | v24.49,22.21 24.79,22.21 C3-10.C | C3-13.C 24.81,17.85 v24.49,17.85 | C3-14.C 24.81,16.4 v24.49,16.4 | C2-10.A 26.98,21.49 27,21.5 27.76,21.5 27.92,21.66 30.71,21.66 v30.86,21.5 | U1.9 18.34,6.22 19.03,5.54 v19.03,5.4
  Top 0.254: v21.57,7.94 21.57,8.45 22.9,9.78 24.02,9.78 v24.62,10.38
  Route2 0.203: v19.03,5.4 20.04,5.4 20.55,5.91 20.55,7.05 21.44,7.94 v21.57,7.94
  Route15 0.254: v30.86,21.5 29.44,22.93 29.44,23.94 28.68,24.7 24.99,24.7 v24.49,24.2 v24.49,22.21 v24.49,20.77 v24.49,17.85 v24.49,16.4 v24.49,14.14 24.62,14 v24.62,10.38
M_CB4  (via drill 0.15)
  Top 0.2: C8-12.A C7-12.A
  Top 0.203: C7-12.A C6-12.A C5-12.A 23.09,18.22 v23.09,17.87 23.39,17.87 C4-13.C | C4-15.C 23.83,13.7 23.55,13.98 23.24,13.98 v23.09,14.14 | v23.09,16.4 23.41,16.4 C4-14.C | v23.09,24.2 23.09,23.97 C4-9.C | C4-10.C 23.39,22.21 v23.09,22.21 | v23.09,20.77 23.39,20.77 C4-11.C | C4-12.C 23.41,19.29 v23.09,19.29 | C3-11.A C2-11.A 30.96,19.97 v31.06,20.08 | U1.10 18.75,6.62 19.21,6.16 v19.28,6.16
  Route2 0.254: v31.06,20.08 31.93,20.08 32.23,20.39 32.23,22.93 31.47,23.69 29.95,23.69 28.93,22.67 26.9,22.67 26.39,23.18 24.11,23.18 v23.09,24.2
  Route15 0.203: 23.14,14.09 v23.09,14.14 | 23.14,6.74 21.8,5.4 20.04,5.4 v19.28,6.16
  Route15 0.254: v23.09,14.14 v23.09,16.4 v23.09,17.87 v23.09,19.29 v23.09,20.77 v23.09,22.21 v23.09,24.2 | 23.14,14.09 23.14,6.74
M_CB5  (via drill 0.15)
  Top 0.2: C8-13.A C7-13.A
  Top 0.203: C2-12.A C3-12.A 25.58,18.46 25.58,18.45 24.25,18.45 C4-12.A 23.78,18.52 v23.75,18.56 | C7-13.A C6-13.A 21.69,16.77 v21.69,16.4 22.01,16.4 C5-14.C | C5-15.C 22.43,13.68 22.12,13.98 21.84,13.98 v21.69,14.14 | v21.69,17.85 22.01,17.85 C5-13.C | v21.69,19.29 22.01,19.29 C5-12.C | v21.69,24.2 21.69,23.97 C5-9.C | v21.69,22.21 21.99,22.21 C5-10.C | v21.69,20.77 21.99,20.77 C5-11.C | U1.11 19.18,7.02 v19.28,6.92
  Top 0.254: v23.95,11.34 v21.72,11.34
  Route2 0.254: v23.75,18.56 22.43,18.56 v21.69,19.29
  Route15 0.203: 21.72,14.11 v21.69,14.14 | 21.72,11.26 v21.72,11.34 | 20.92,8.06 19.79,6.92 v19.28,6.92
  Route15 0.254: v21.69,24.2 v21.69,22.21 v21.69,20.77 v21.69,19.29 v21.69,17.85 v21.69,16.4 v21.69,14.14 | v21.72,11.34 21.72,14.11 | 21.72,11.26 20.92,10.46 20.92,8.06
M_CB6  (via drill 0.15)
  Top 0.2: C8-14.A C7-14.A
  Top 0.203: C2-13.A C3-13.A C4-13.A C5-13.A 22.39,17.07 v22.35,17.11 | C6-15.C 21.03,13.66 20.7,13.98 20.42,13.98 v20.27,14.14 | v20.27,22.21 20.59,22.21 C6-10.C | v20.27,19.32 20.59,19.32 C6-12.C | v20.27,16.4 20.61,16.4 C6-14.C 19.98,15.64 C7-14.A | v20.27,24.2 20.27,23.99 C6-9.C | v20.27,20.74 20.62,20.74 C6-11.C | v20.27,17.85 20.61,17.85 C6-13.C | U1.12 18.66,7.42 18.92,7.69 v19.28,7.69
  Route2 0.254: v22.35,17.11 21.01,17.11 v20.27,17.85
  Route15 0.203: 20.3,8.19 19.79,7.69 v19.28,7.69
  Route15 0.254: v20.27,24.2 v20.27,22.21 v20.27,20.74 v20.27,19.32 v20.27,17.85 v20.27,16.4 v20.27,14.14 20.3,14.11 20.3,8.19
M_CB7  (via drill 0.15)
  Top 0.2: v18.87,24.2 18.87,23.99 C7-9.C | v18.87,20.74 19.22,20.74 C7-11.C | v18.87,16.4 19.21,16.4 C7-14.C | v18.87,22.21 19.19,22.21 C7-10.C | v18.87,19.29 19.21,19.29 C7-12.C | v18.87,17.85 19.21,17.85 C7-13.C
  Top 0.203: C2-14.A C3-14.A C4-14.A C5-14.A C6-14.A 20.56,14.8 19.53,14.8 v18.87,14.14 19.03,13.98 19.48,13.98 19.63,13.84 C7-15.C | U1.13 18.4,7.82 19.03,8.45 v19.53,8.45 | C8-15.A 18.23,11.53 18.52,11.24 18.92,11.24 v18.97,11.29
  Route15 0.203: 18.87,11.39 v18.97,11.29 19.53,10.73 v19.53,8.45
  Route15 0.254: v18.87,24.2 v18.87,22.21 v18.87,20.74 v18.87,19.29 v18.87,17.85 v18.87,16.4 v18.87,14.14 18.87,11.39
M_CB8  (via drill 0.15)
  Top 0.2: C2-15.A C3-15.A | C8-11.C 17.82,20.74 v17.48,20.74 | v17.48,19.32 17.79,19.32 C8-12.C | v17.48,16.4 17.81,16.4 C8-14.C | v17.48,24.2 17.48,23.98 C8-9.C | v17.52,22.24 17.76,22.24 C8-10.C | v17.48,17.87 17.79,17.87 C8-13.C
  Top 0.203: C3-15.A C4-15.A C5-15.A C6-15.A C7-15.A 19.61,12.16 19.08,12.16 18.87,12.36 18.87,12.97 18.66,13.18 C8-15.C 18.23,13.81 18.06,13.98 17.63,13.98 v17.48,14.14 | U1.14 18.13,8.22 18.44,8.53 18.44,10.31 v17.5,11.24
  Route15 0.203: 17.5,14.11 v17.48,14.14
  Route15 0.254: v17.48,24.2 17.52,24.15 v17.52,22.24 17.52,20.79 v17.48,20.74 v17.48,19.32 v17.48,17.87 v17.48,16.4 v17.48,14.14 | v17.5,11.24 17.5,14.11
M_SCL  (via drill 0.15)
  Top 0.203: U1.20 15.1,9.93 v14.81,10.23
  Top 0.254: v10.42,1.37 R6.1
  Route2 0.203: 14.71,10.33 v14.81,10.23
  Route2 0.254: v30.71,19.37 29.44,19.37 26.85,16.78 26.85,13.6 26.14,12.88 16.6,12.88 14.71,10.99 14.71,10.33 | v14.81,10.23 14.73,10.15 14.73,4.62 15.22,4.13 15.22,2.86 14.45,2.1 11.15,2.1 v10.42,1.37
  Bottom 0.254: M_SCL.TP 26.41,20.78 26.41,22.03 25.45,22.99 | K1.4 6.15,20.08 6.89,20.82 6.89,22.6 7.28,22.99 25.45,22.99 | 25.45,22.99 27.09,22.99 v30.71,19.37
M_SDA  (via drill 0.15)
  Top 0.203: U1.19 v15.5,10.74 v15.5,10.75
  Top 0.305: R4.1
  Top 0.406: v25.88,5.4 25.47,4.99 R4.1
  Route2 0.254: v25.88,5.4 25.88,5.65 27.77,7.54 27.77,10.63 26.39,12 | v30.71,18.1 29.19,18.1 27.66,16.58 27.66,13.27 26.39,12 | 26.39,12 16.75,12 v15.5,10.75
  Bottom 0.254: M_SDA.TP 29.74,15.32 30.21,15.32 30.71,15.82 v30.71,18.1 | K1.3 4.79,19.08 5.32,18.55 6.37,18.55 6.94,17.98 6.94,13.37 7.9,12.41 14.78,12.41 15.5,11.7 v15.5,10.75
N$1  (via drill 0.15)
  Top 0.254: v8.87,5.4 9.7,4.57 S2.2
  Top 0.305: S2.2 9.7,6.18 R2.1 8.6,7.87 7.76,8.71 R5.1 | C3.1 5.57,5.16 v5.56,5.15
  Route2 0.254: v5.56,5.15 8.61,5.15 v8.87,5.4
N$2  (via drill 0.15, 0.25)
  Top 0.254: R1.1 23.48,8.51 S1.2 23.37,4.48 23.01,4.48 22.78,4.24 v22.78,3.08 v22.78,3.07
  Top 0.305: v28.93,4.13 28.93,5.52 31.32,7.91 31.32,9.06 C2.1 31.4,10.44 R3.1
  Route2 0.203: v28.93,4.13 28.68,4.13 | 23.84,4.13 v22.78,3.07
  Route2 0.254: 28.68,4.13 23.84,4.13
R_EXT
  Top 0.203: U1.6 16.7,4.17 17.4,3.47 18.87,3.47 19.53,4.13 21.31,4.13 21.82,3.62 21.82,2.1 21.1,1.38 R8.2
S_DOWN  (via drill 0.15)
  Top 0.254: R5.2 9.63,9.46 10.33,8.76 10.33,6.6 10.8,6.13 10.8,4.31 10.61,4.13 v10.45,4.13
  Route2 0.203: 3.79,4.91 3.79,4.89
  Route2 0.254: 3.79,4.91 3.79,23.34 6.34,25.89 25.97,25.89 v28.42,23.43 | 3.79,4.89 4.29,4.38 10.2,4.38 v10.45,4.13
  Bottom 0.254: v28.42,23.43 27.22,24.64 S_DOWN.TP 24.51,26.27 6.64,26.27 K1.6
S_UP  (via drill 0.15, 0.25)
  Top 0.2: v29.12,12.62 R3.2
  Route15 0.203: v29.12,12.62 29.04,12.71
  Route15 0.254: 29.04,12.71 29.04,19.73 29.98,20.67 v29.98,20.99
  Bottom 0.203: 29.9,21.08 v29.98,20.99
  Bottom 0.254: S_UP.TP 29.7,12.62 v29.12,12.62 | K1.5 4.26,21.08 5.11,21.93 5.11,22.55 5.52,22.96 6.39,22.96 6.83,23.4 27.58,23.4 29.9,21.08
VCC  (via drill 0.15)
  Top 0.2: U1.3 15.5,4.54 15.23,4.27 15.1,4.27
  Top 0.203: 15.99,2.4 C4.1 | U1.2 15.1,4.27
  Top 0.305: v7.6,3.62 6.76,2.78 R6.2 4.02,1.37 C1.1
  Top 0.406: v7.6,3.62 v7.59,3.62 7.59,5.89 6.9,6.58 R2.2 | 15.99,2.4 C5.1 14.13,3.43 v13.95,3.62 14.45,3.62 15.1,4.27 | R1.2 25.09,6.95 v25.12,6.92 24.48,6.28 24.48,2.98 23.77,2.26 R4.2 23.1,1.29 v22.57,0.76 | C4.1 16.04,1.02 v16.23,0.83
  Route2 0.406: v32.49,16.07 32.49,16.32 31.98,16.83 v29.69,16.83 | v22.57,0.76 16.3,0.76 v16.23,0.83 | v13.95,3.62 11.41,3.62 10.9,3.11 8.1,3.11 v7.6,3.62
  Route15 0.406: v32.49,16.07 32.49,8.19 30.96,6.67 25.38,6.67 v25.12,6.92
  Bottom 0.254: VCC.TP 31.93,9.33 32.49,9.88 v32.49,16.07 | K1.1 2.45,12.19 7.6,7.04 v7.6,3.62
  pour Route2: -0.7,28.77 33.8,28.77 34.3,28.27 34.3,-0.73 -0.7,-0.73

### Text on the board
bNames: sep-display_falcon_v8